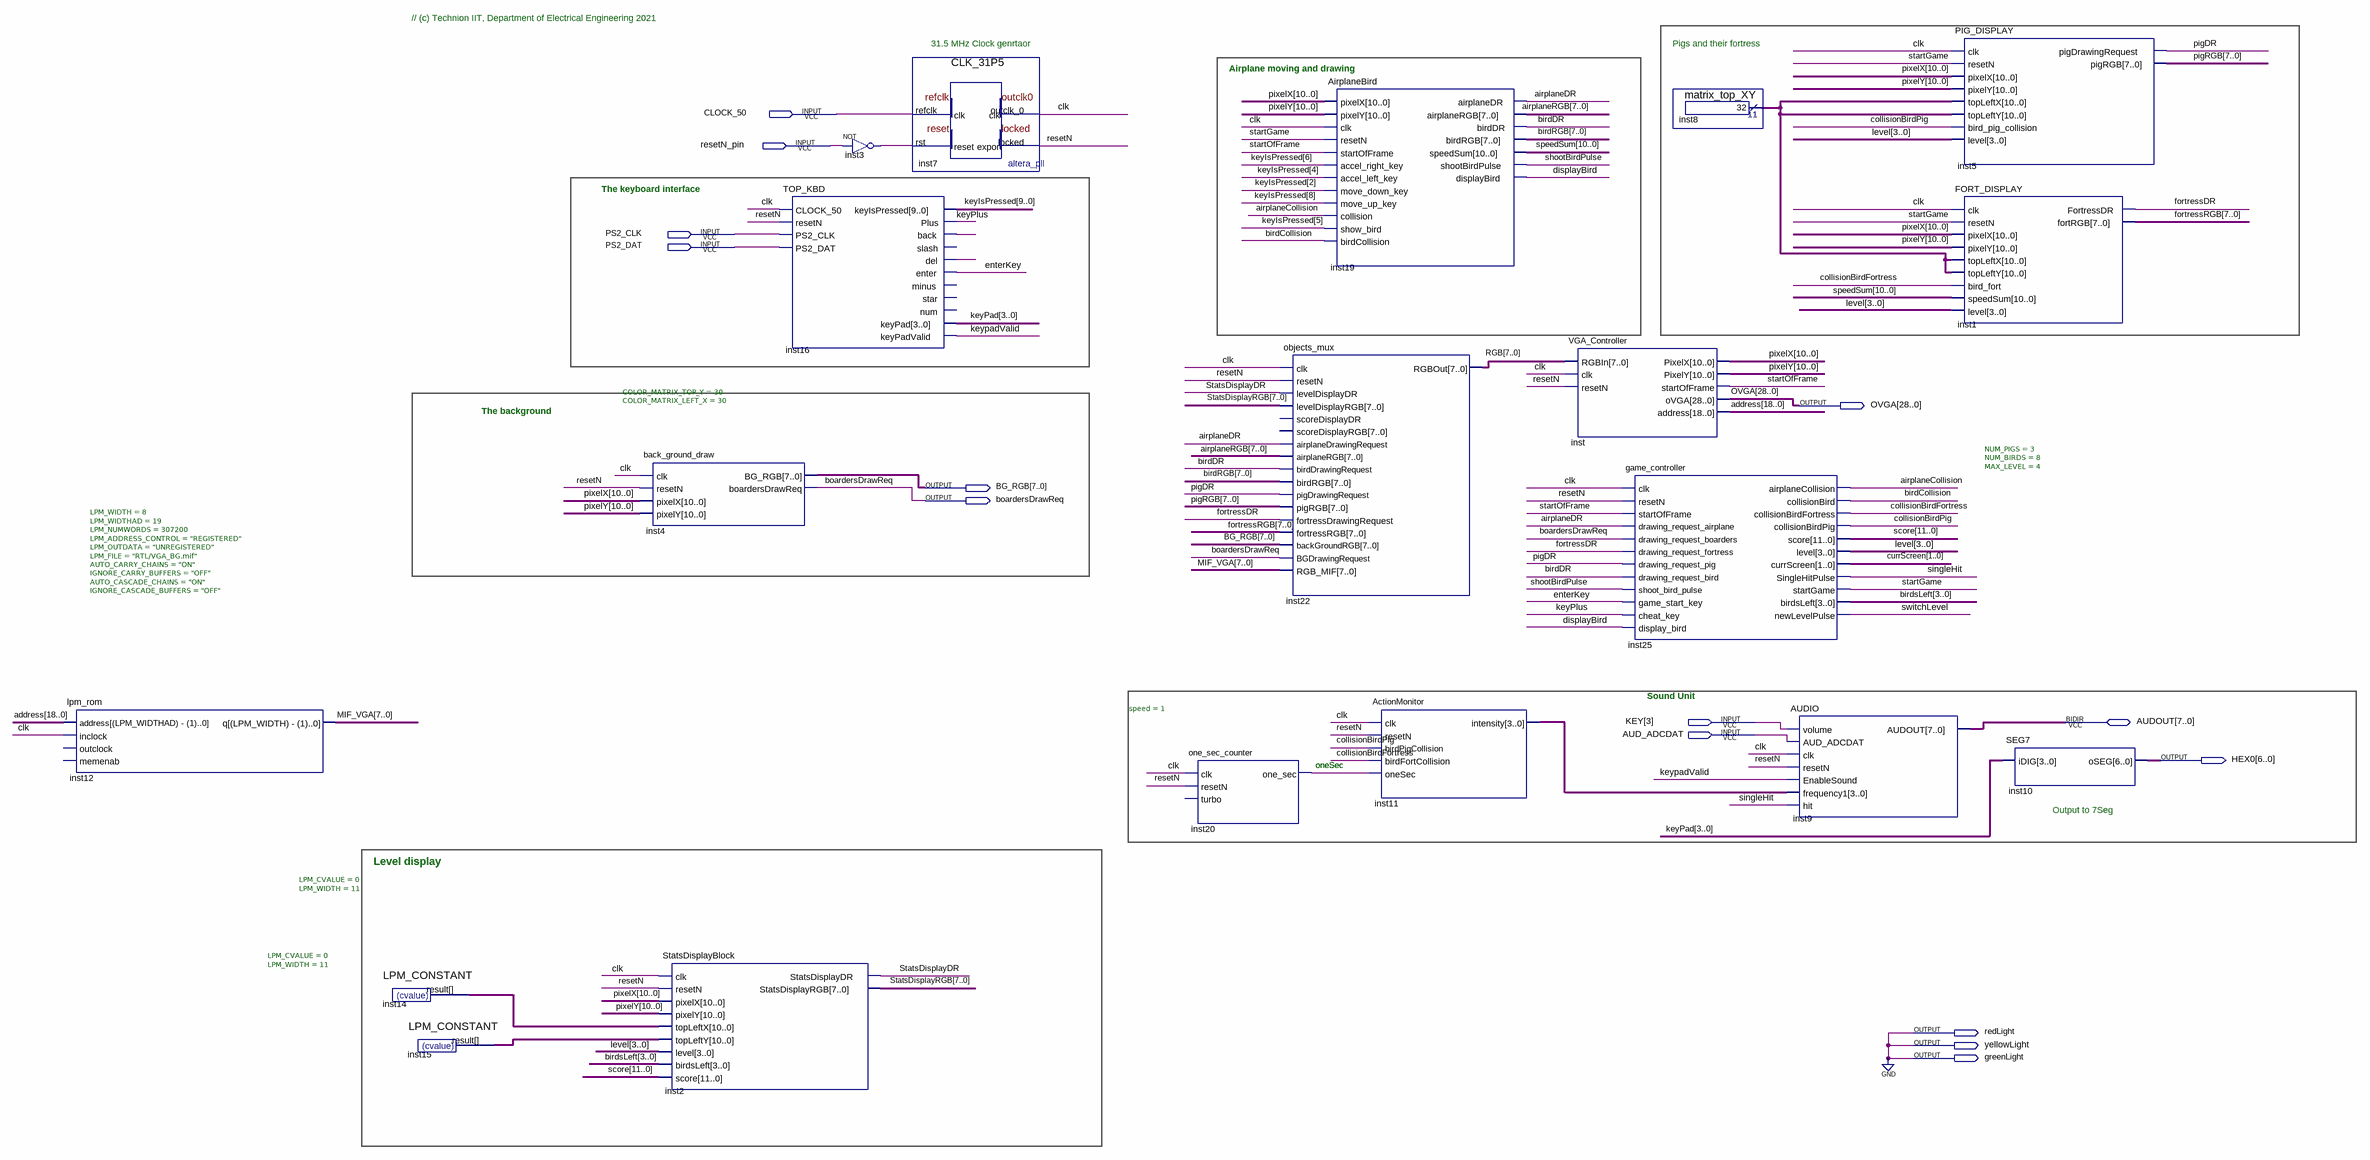
[diagram p0: schematic sheet]
// Quartus schematic TOP_VGA_KBD.bdf as structural Verilog: 19 symbols, 14 pins
module TOP_VGA_KBD (
  input  CLOCK_50,
  input  resetN_pin,
  input  PS2_CLK,
  input  PS2_DAT,
  input  [3:3] KEY,
  input  AUD_ADCDAT,
  inout  [7:0] AUDOUT,
  output [28:0] OVGA,
  output [7:0] BG_RGB,
  output boardersDrawReq,
  output [6:0] HEX0,
  output redLight,
  output yellowLight,
  output greenLight
);

  wire airplaneCollision, airplaneDR, birdCollision, birdDR, clk, collisionBirdFortress, collisionBirdPig,
       displayBird, enterKey, fortressDR, inst3_out, inst16_back, inst16_del, keypadValid, keyPlus, oneSec,
       pigDR, resetN, shootBirdPulse, singleHit, startGame, startOfFrame, StatsDisplayDR, switchLevel;
  wire [1:0] currScreen;
  wire [3:0] birdsLeft, inst11_intensity, keyPad, level;
  wire [7:0] airplaneRGB, birdRGB, fortressRGB, MIF_VGA, pigRGB, RGB, StatsDisplayRGB;
  wire [9:0] keyIsPressed;
  wire [10:0] inst8_result, inst14_result, inst15_result, pixelX, pixelY, speedSum;
  wire [11:0] score;
  wire [18:0] address;

  lpm_rom #(.LPM_WIDTH(8), .LPM_WIDTHAD(19), .LPM_NUMWORDS(307200), .LPM_ADDRESS_CONTROL("REGISTERED"), .LPM_OUTDATA("UNREGISTERED"), .LPM_FILE("RTL/VGA_BG.mif"), .AUTO_CARRY_CHAINS("ON"), .IGNORE_CARRY_BUFFERS("OFF"), .AUTO_CASCADE_CHAINS("ON"), .IGNORE_CASCADE_BUFFERS("OFF")) inst12 (
    .address(address), .inclock(clk), .q(MIF_VGA));  // open: outclock, memenab
  LPM_CONSTANT #(.LPM_CVALUE(0), .LPM_WIDTH(11)) inst14 (.result(inst14_result));
  LPM_CONSTANT #(.LPM_CVALUE(0), .LPM_WIDTH(11)) inst15 (.result(inst15_result));
  back_ground_draw #(.COLOR_MATRIX_TOP_Y(30), .COLOR_MATRIX_LEFT_X(30)) inst4 (
    .clk(clk), .resetN(resetN), .pixelX(pixelX), .pixelY(pixelY), .BG_RGB(BG_RGB),
    .boardersDrawReq(boardersDrawReq));
  StatsDisplayBlock inst2 (
    .clk(clk), .resetN(resetN), .pixelX(pixelX), .pixelY(pixelY), .topLeftX(inst14_result),
    .topLeftY(inst15_result), .level(level), .birdsLeft(birdsLeft), .score(score),
    .StatsDisplayDR(StatsDisplayDR), .StatsDisplayRGB(StatsDisplayRGB));
  TOP_KBD inst16 (
    .CLOCK_50(clk), .resetN(resetN), .PS2_CLK(PS2_CLK), .PS2_DAT(PS2_DAT), .keyIsPressed(keyIsPressed),
    .Plus(keyPlus), .back(inst16_back), .del(inst16_del), .enter(enterKey), .keyPad(keyPad),
    .keyPadValid(keypadValid));  // open: slash, minus, star, num
  not inst3 (inst3_out, resetN_pin);
  CLK_31P5 inst7 (.refclk(CLOCK_50), .rst(inst3_out), .outclk_0(clk), .locked(resetN));
  one_sec_counter #(.speed(1)) inst20 (.clk(clk), .resetN(resetN), .one_sec(oneSec));  // open: turbo
  objects_mux inst22 (
    .clk(clk), .resetN(resetN), .levelDisplayDR(StatsDisplayDR), .levelDisplayRGB(StatsDisplayRGB),
    .airplaneDrawingRequest(airplaneDR), .airplaneRGB(airplaneRGB), .birdDrawingRequest(birdDR),
    .birdRGB(birdRGB), .pigDrawingRequest(pigDR), .pigRGB(pigRGB), .fortressDrawingRequest(fortressDR),
    .fortressRGB(fortressRGB), .backGroundRGB(BG_RGB), .BGDrawingRequest(boardersDrawReq), .RGB_MIF(MIF_VGA),
    .RGBOut(RGB));  // open: scoreDisplayDR, scoreDisplayRGB
  AirplaneBird inst19 (
    .pixelX(pixelX), .pixelY(pixelY), .clk(clk), .resetN(startGame), .startOfFrame(startOfFrame),
    .accel_right_key(keyIsPressed[6]), .accel_left_key(keyIsPressed[4]), .move_down_key(keyIsPressed[2]),
    .move_up_key(keyIsPressed[8]), .collision(airplaneCollision), .show_bird(keyIsPressed[5]),
    .birdCollision(birdCollision), .airplaneDR(airplaneDR), .airplaneRGB(airplaneRGB), .birdDR(birdDR),
    .birdRGB(birdRGB), .speedSum(speedSum), .shootBirdPulse(shootBirdPulse), .displayBird(displayBird));
  ActionMonitor inst11 (
    .clk(clk), .resetN(resetN), .birdPigCollision(collisionBirdPig),
    .birdFortCollision(collisionBirdFortress), .oneSec(oneSec), .intensity(inst11_intensity));
  VGA_Controller inst (
    .RGBIn(RGB), .clk(clk), .resetN(resetN), .PixelX(pixelX), .PixelY(pixelY), .startOfFrame(startOfFrame),
    .oVGA(OVGA), .address(address));
  game_controller #(.NUM_PIGS(3), .NUM_BIRDS(8), .MAX_LEVEL(4)) inst25 (
    .clk(clk), .resetN(resetN), .startOfFrame(startOfFrame), .drawing_request_airplane(airplaneDR),
    .drawing_request_boarders(boardersDrawReq), .drawing_request_fortress(fortressDR),
    .drawing_request_pig(pigDR), .drawing_request_bird(birdDR), .shoot_bird_pulse(shootBirdPulse),
    .game_start_key(enterKey), .cheat_key(keyPlus), .display_bird(displayBird),
    .airplaneCollision(airplaneCollision), .collisionBird(birdCollision),
    .collisionBirdFortress(collisionBirdFortress), .collisionBirdPig(collisionBirdPig), .score(score),
    .level(level), .currScreen(currScreen), .SingleHitPulse(singleHit), .startGame(startGame),
    .birdsLeft(birdsLeft), .newLevelPulse(switchLevel));
  matrix_top_XY inst8 (.result(inst8_result));
  AUDIO inst9 (
    .volume(KEY[3]), .AUD_ADCDAT(AUD_ADCDAT), .clk(clk), .resetN(resetN), .EnableSound(keypadValid),
    .frequency1(inst11_intensity), .hit(singleHit), .AUDOUT(AUDOUT));
  PIG_DISPLAY inst5 (
    .clk(clk), .resetN(startGame), .pixelX(pixelX), .pixelY(pixelY), .topLeftX(inst8_result),
    .topLeftY(inst8_result), .bird_pig_collision(collisionBirdPig), .level(level), .pigDrawingRequest(pigDR),
    .pigRGB(pigRGB));
  FORT_DISPLAY inst1 (
    .clk(clk), .resetN(startGame), .pixelX(pixelX), .pixelY(pixelY), .topLeftX(inst8_result),
    .topLeftY(inst8_result), .bird_fort(collisionBirdFortress), .speedSum(speedSum), .level(level),
    .FortressDR(fortressDR), .fortRGB(fortressRGB));
  SEG7 inst10 (.iDIG(keyPad), .oSEG(HEX0));

  assign greenLight = 1'b0;
  assign redLight = 1'b0;
  assign yellowLight = 1'b0;

  // Notes on the sheet:
  //   // (c) Technion IIT, Department of Electrical Engineering 2021
  //   31.5 MHz Clock genrtaor
  //   Pigs and their fortress
  //   Airplane moving and drawing
  //   The keyboard interface
  //   The background 
  //   Sound Unit
  //   oneSec
  //   Output to 7Seg
  //   Level display
endmodule
